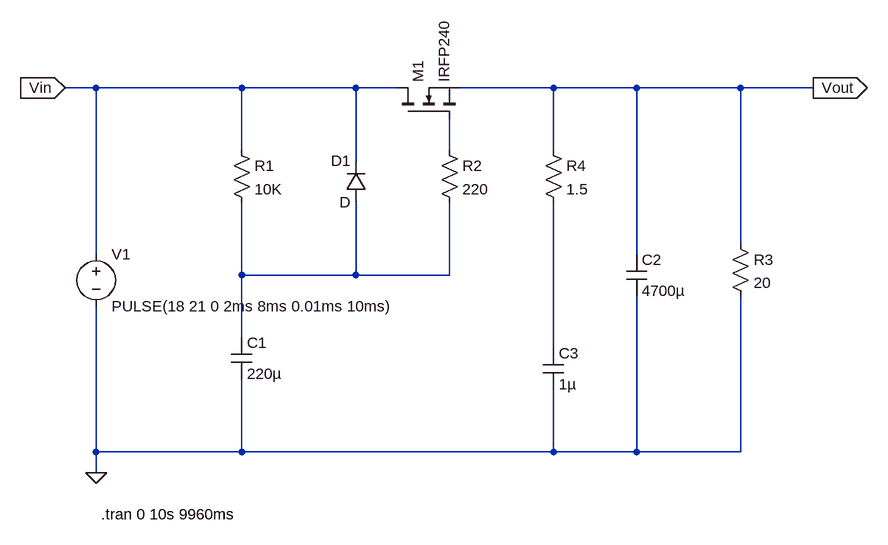
[diagram p0: schematic ripple_filter_pos_mosfet.asc]
ripple_filter_pos_mosfet.asc, the LTspice schematic file:
Version 4
SHEET 1 1472 680
WIRE 256 -96 208 -96
WIRE 480 -96 256 -96
WIRE 656 -96 480 -96
WIRE 720 -96 656 -96
WIRE 960 -96 816 -96
WIRE 1088 -96 960 -96
WIRE 1248 -96 1088 -96
WIRE 1360 -96 1248 -96
WIRE 480 0 480 -96
WIRE 800 0 800 -48
WIRE 960 0 960 -96
WIRE 656 16 656 -96
WIRE 1248 144 1248 -96
WIRE 256 160 256 -96
WIRE 1088 160 1088 -96
WIRE 480 192 480 80
WIRE 656 192 656 80
WIRE 656 192 480 192
WIRE 800 192 800 80
WIRE 800 192 656 192
WIRE 480 288 480 192
WIRE 960 304 960 80
WIRE 256 464 256 240
WIRE 480 464 480 352
WIRE 480 464 256 464
WIRE 960 464 960 368
WIRE 960 464 480 464
WIRE 1088 464 1088 224
WIRE 1088 464 960 464
WIRE 1248 464 1248 224
WIRE 1248 464 1088 464
WIRE 256 496 256 464
FLAG 256 496 0
FLAG 208 -96 Vin
IOPIN 208 -96 In
FLAG 1360 -96 Vout
IOPIN 1360 -96 Out
SYMBOL voltage 256 144 R0
WINDOW 123 0 0 Left 0
WINDOW 39 0 0 Left 0
SYMATTR InstName V1
SYMATTR Value PULSE(18 21 0 2ms 8ms 0.01ms 10ms)
SYMBOL res 464 -16 R0
SYMATTR InstName R1
SYMATTR Value 10K
SYMBOL cap 464 288 R0
SYMATTR InstName C1
SYMATTR Value 220µ
SYMBOL diode 672 80 R180
WINDOW 0 24 64 Left 2
WINDOW 3 24 0 Left 2
SYMATTR InstName D1
SYMBOL nmos 720 -48 R270
SYMATTR InstName M1
SYMATTR Value IRFP240
SYMBOL res 784 -16 R0
SYMATTR InstName R2
SYMATTR Value 220
SYMBOL cap 1072 160 R0
SYMATTR InstName C2
SYMATTR Value 4700µ
SYMBOL res 1232 128 R0
SYMATTR InstName R3
SYMATTR Value 20
SYMBOL res 944 -16 R0
SYMATTR InstName R4
SYMATTR Value 1.5
SYMBOL cap 944 304 R0
SYMATTR InstName C3
SYMATTR Value 1µ
TEXT 264 560 Left 2 !.tran 0 10s 9960ms

The netlist it stands for:
* ripple_filter_pos_mosfet.asc
V1 Vin 0 PULSE(18 21 0 2ms 8ms 0.01ms 10ms)
R1 Vin N002 10K
C1 N002 0 220µ
D1 N002 Vin D
M1 Vin N001 Vout Vout IRFP240
R2 N001 N002 220
C2 Vout 0 4700µ
R3 Vout 0 20
R4 Vout N003 1.5
C3 N003 0 1µ
.model D D
.lib standard.dio
.model NMOS NMOS
.model PMOS PMOS
.lib standard.mos
.tran 0 10s 9960ms
.backanno
.end